# Altium schematic sheet 6612.SchDoc
size A4
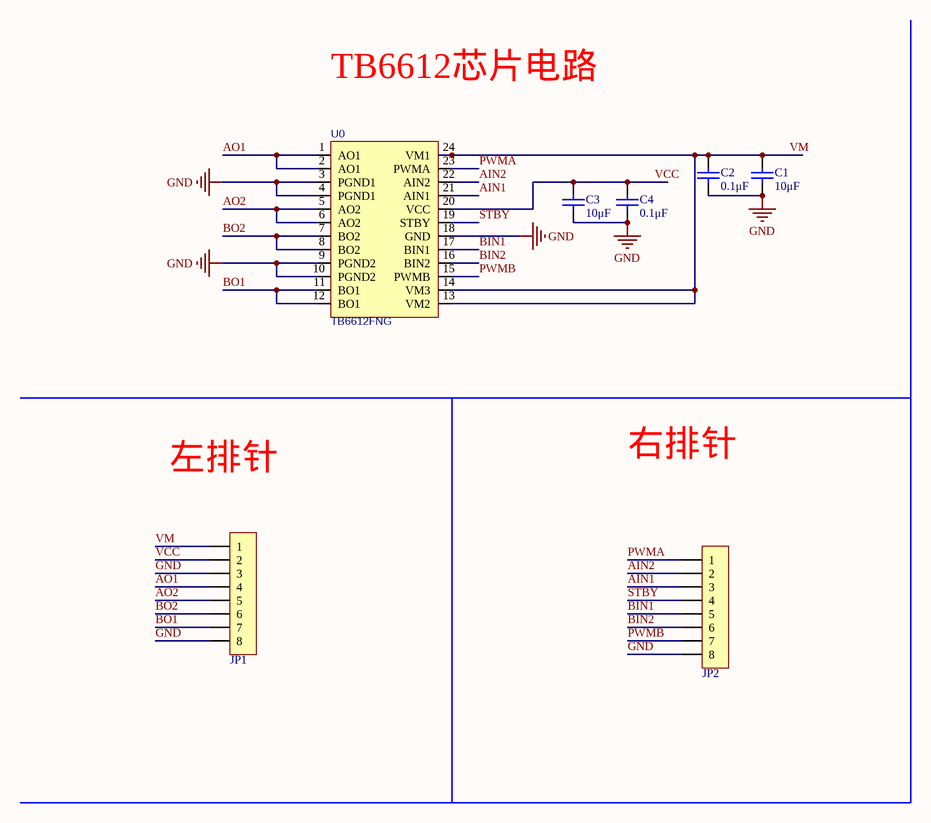
[diagram p0: 6612.SchDoc]

## Parts
C1  10μF  [C0805_L]
C2  0.1μF  [C0805_L]
C3  10μF  [C0805_L]
C4  0.1μF  [C0805_L]
JP1  HDR-1X8  [HDR2.54-LI-8P]  (value not drawn)
JP2  HDR-1X8  [HDR2.54-LI-8P]  (value not drawn)
U0  TB6612FNG  [SSOP24_M]

## Nets
GND: C1.1 C2.1 C3.1 C4.1 JP1.3 JP1.8 JP2.8 U0.3(PGND1) U0.4(PGND1) U0.9(PGND2) U0.10(PGND2) U0.18(GND)
AIN1: JP2.3 U0.21(AIN1)
AIN2: JP2.2 U0.22(AIN2)
AO1: JP1.4 U0.1(AO1) U0.2(AO1)
AO2: JP1.5 U0.5(AO2) U0.6(AO2)
BIN1: JP2.5 U0.17(BIN1)
BIN2: JP2.6 U0.16(BIN2)
BO1: JP1.7 U0.11(BO1) U0.12(BO1)
BO2: JP1.6 U0.7(BO2) U0.8(BO2)
PWMA: JP2.1 U0.23(PWMA)
PWMB: JP2.7 U0.15(PWMB)
STBY: JP2.4 U0.19(STBY)
VCC: C3.2 C4.2 JP1.2 U0.20(VCC)
VM: C1.2 C2.2 JP1.1 U0.13(VM2) U0.14(VM3) U0.24(VM1)

## Notes on the sheet
- TB6612芯片电路
- 左排针
- 右排针

## Library data of the parts
C1-C4 = C: 贴片电容/MLCC电容; BOM名称: 无极性贴片电容; 联系卖家，免费查找封装: 唯一出售店铺网址https://shop463601444.taobao.com
JP1 JP2 = Header 8: 8P接插件; 联系卖家，免费查找封装: 唯一出售店铺网址https://shop463601444.taobao.com; 封装库来自淘宝卖家ID:黄晶宝石: 其他店铺购入均为盗版假冒封装库，请立即申请退款，本店现金奖励20~200元; BOM名称: 8P接插件
U0 = TB6612FNG: 电机驱动; 联系卖家 免费查找封装: 唯一出售店铺网址https://shop463601444.taobao.com; BOM名称: TB6612FNG